# Altium schematic sheet PAGE1-CONTENTS.SchDoc
size A3; DocumentNumber: 1; SheetNumber: 1; SheetTotal: 2
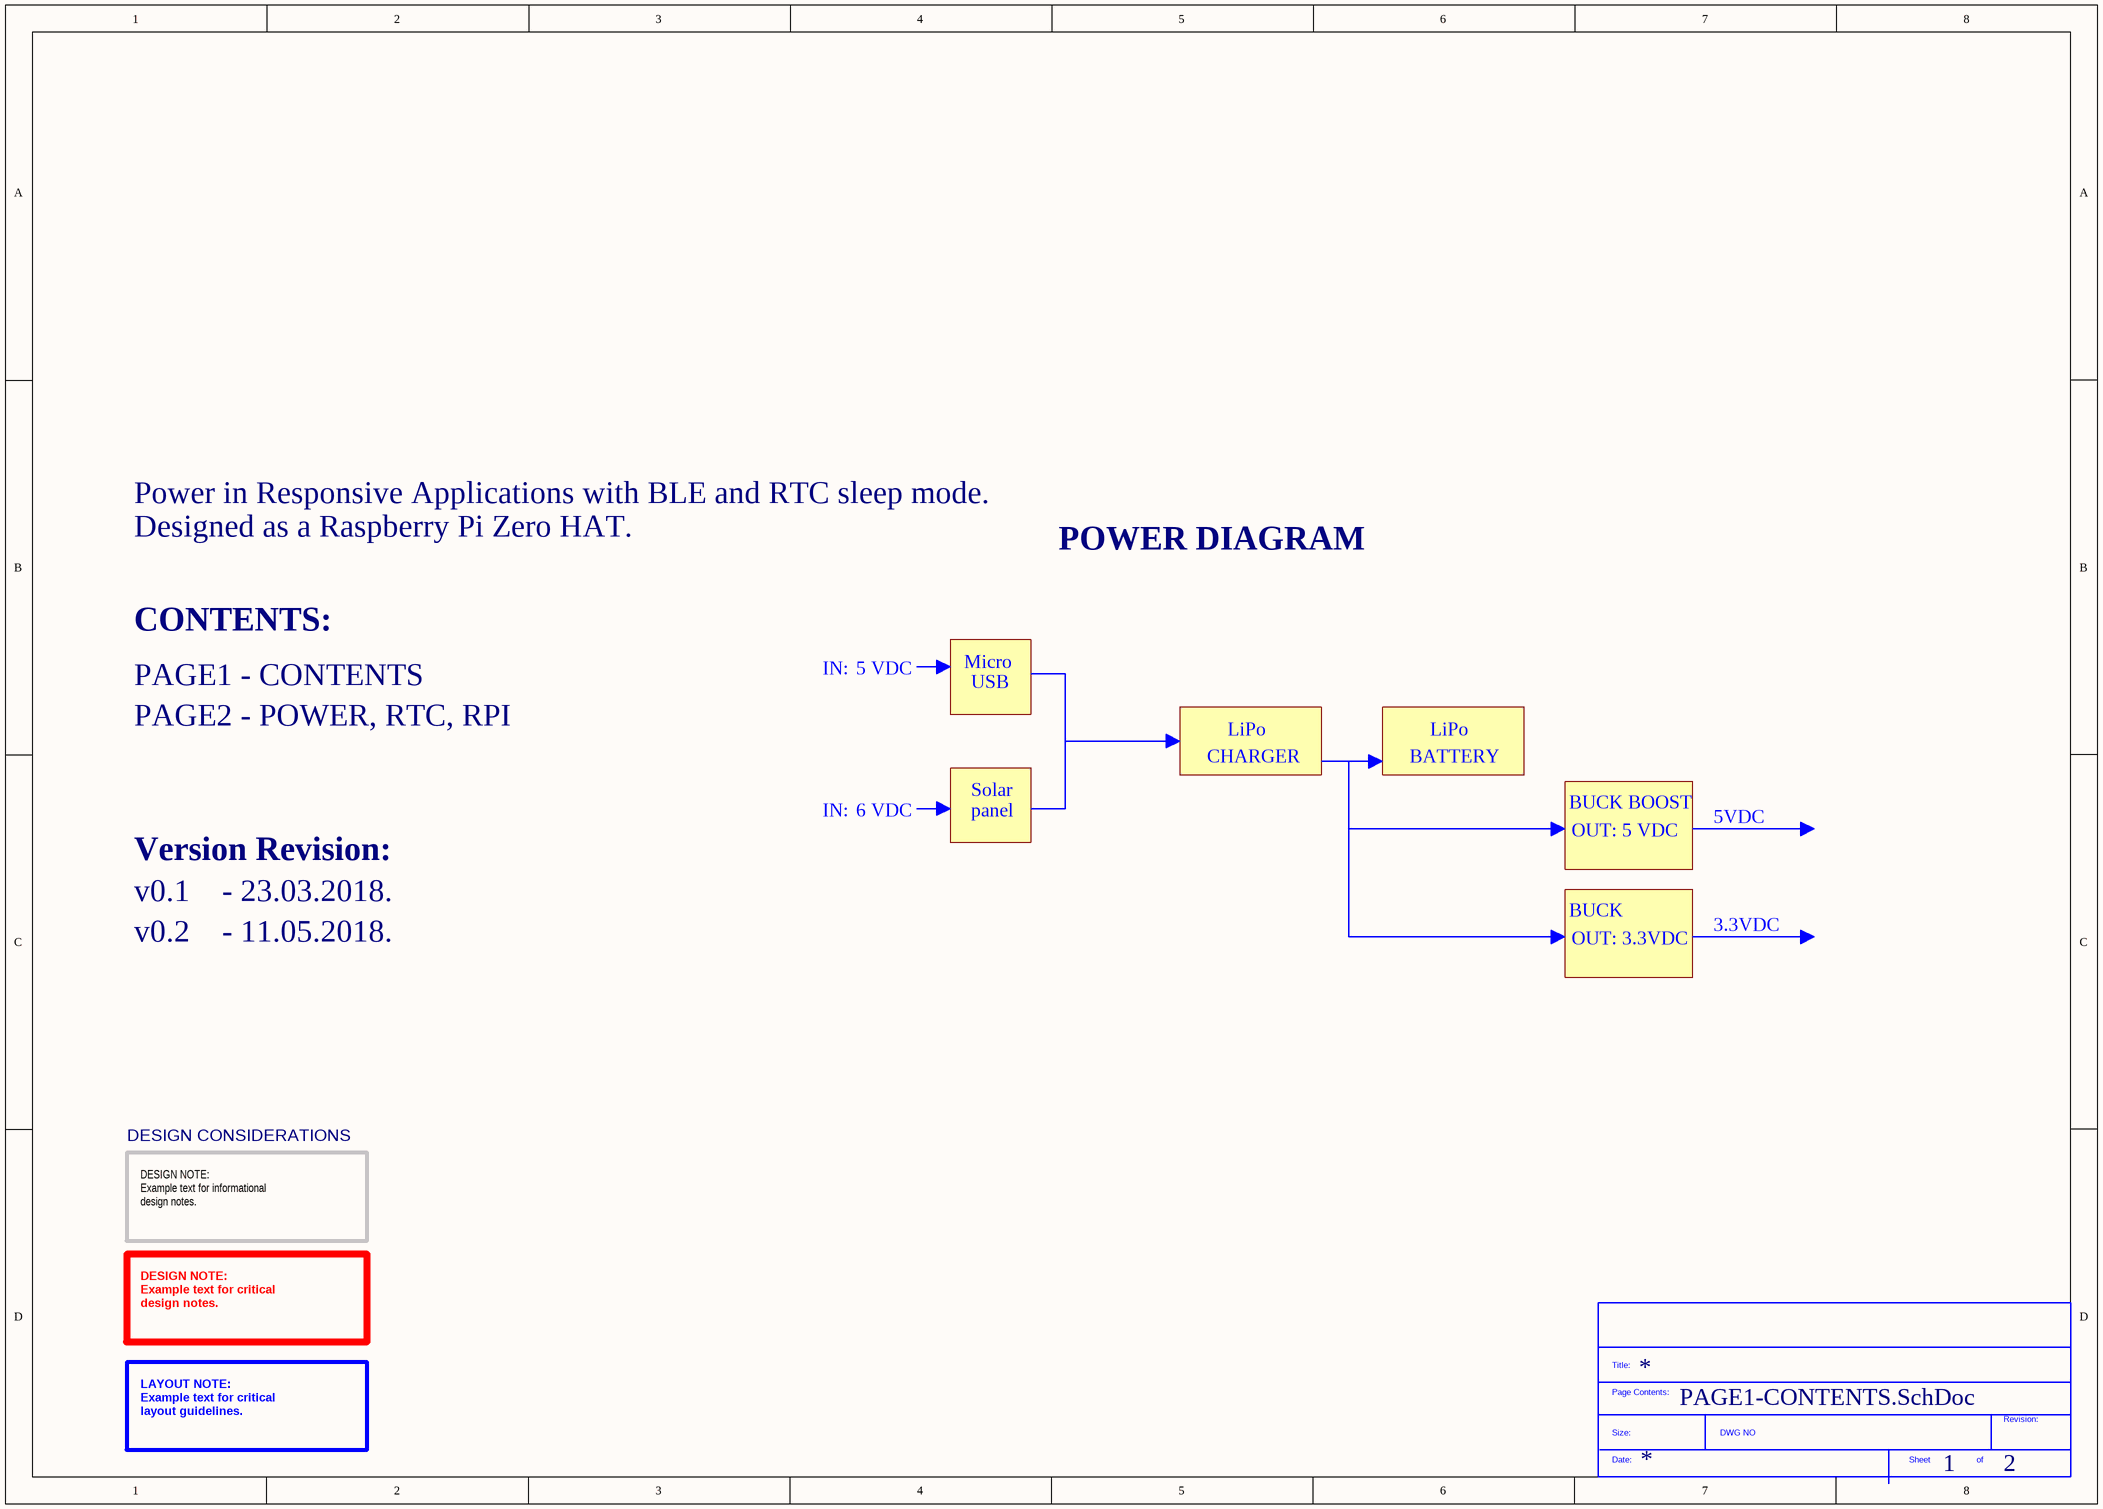
[diagram p0: PAGE1-CONTENTS.SchDoc]

## Parts
*?  SDTitleBlock  (value not drawn)  (graphical)

## Notes on the sheet
- Power in Responsive Applications with BLE and RTC sleep mode.
- Designed as a Raspberry Pi Zero HAT.
- POWER DIAGRAM
- CONTENTS:
- PAGE1 - CONTENTS
- IN:
- 5 VDC
- Micro
- USB
- PAGE2 - POWER, RTC, RPI
- CHARGER
- LiPo
- BATTERY
- 6 VDC
- Solar
- panel
- BUCK BOOST
- OUT: 5 VDC
- 5VDC
- Version Revision:
- v0.1    - 23.03.2018.
- BUCK
- v0.2    - 11.05.2018.
- OUT: 3.3VDC
- 3.3VDC
- DESIGN CONSIDERATIONS
- DESIGN NOTE:
  Example text for informational
  design notes.
- DESIGN NOTE:
  Example text for critical
  design notes.
- LAYOUT NOTE:
  Example text for critical
  layout guidelines.
- (in symbol SDTitleBlock) Title:; Page Contents:; Revision:; Size:; DWG NO; Date:; Sheet; of